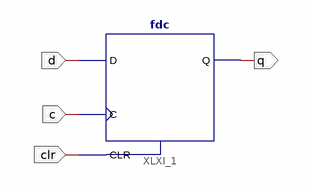
[diagram p0: schematic sheet 1]
// Xilinx ISE schematic reg_test.sch (spartan3e) as structural Verilog: 1 symbols, 4 ports
module reg_test (
  input  c,
  input  clr,
  input  d,
  output q
);

  fdc XLXI_1 (.C(c), .CLR(clr), .D(d), .Q(q));
endmodule
